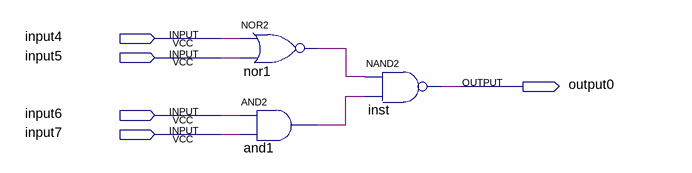
[diagram p0: schematic sheet]
// Quartus schematic lab2_logic.bdf as structural Verilog: 3 symbols, 5 pins
module lab2_logic (
  input  input4,
  input  input5,
  input  input6,
  input  input7,
  output output0
);

  wire and1_out, nor1_out;

  nor nor1 (nor1_out, input4, input5);
  and and1 (and1_out, input6, input7);
  nand inst (output0, nor1_out, and1_out);
endmodule
